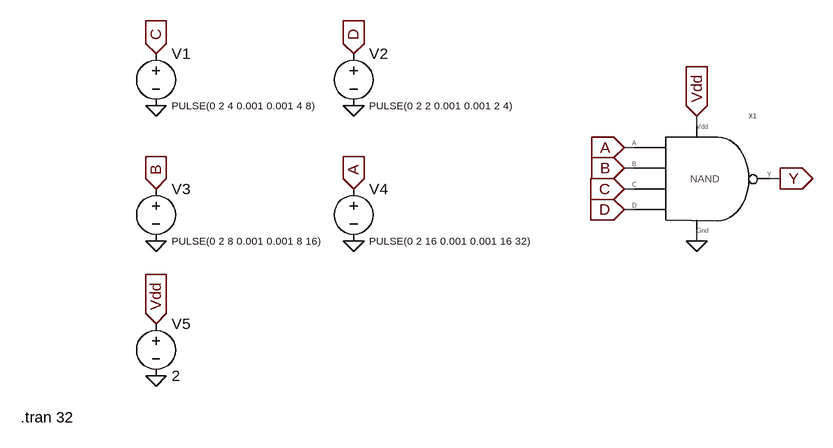
[diagram p0: schematic 4nand symbol.asc]
4nand symbol.asc, the LTspice schematic file:
Version 4
SHEET 1 880 680
WIRE 368 128 368 112
WIRE 272 160 256 160
WIRE 272 192 256 192
WIRE 496 208 480 208
WIRE 272 224 256 224
WIRE 272 256 256 256
WIRE 368 304 368 288
FLAG -464 432 Vdd
IOPIN -464 432 In
FLAG -160 16 D
IOPIN -160 16 In
FLAG -464 16 C
IOPIN -464 16 In
FLAG -464 224 B
IOPIN -464 224 In
FLAG -464 512 0
FLAG -160 304 0
FLAG -464 304 0
FLAG -464 96 0
FLAG -160 96 0
FLAG -160 224 A
IOPIN -160 224 In
FLAG 256 256 D
IOPIN 256 256 In
FLAG 256 224 C
IOPIN 256 224 In
FLAG 256 192 B
IOPIN 256 192 In
FLAG 256 160 A
IOPIN 256 160 In
FLAG 368 112 Vdd
IOPIN 368 112 In
FLAG 368 304 0
FLAG 496 208 Y
IOPIN 496 208 Out
SYMBOL 4nand 352 208 R0
SYMATTR InstName X1
SYMBOL voltage -464 0 R0
WINDOW 3 24 96 Left 1
WINDOW 123 0 0 Left 0
WINDOW 39 0 0 Left 0
SYMATTR Value PULSE(0 2 4 0.001 0.001 4 8)
SYMATTR InstName V1
SYMBOL voltage -160 0 R0
WINDOW 3 24 96 Left 1
WINDOW 123 0 0 Left 0
WINDOW 39 0 0 Left 0
SYMATTR Value PULSE(0 2 2 0.001 0.001 2 4)
SYMATTR InstName V2
SYMBOL voltage -464 208 R0
WINDOW 3 24 96 Left 1
WINDOW 123 0 0 Left 0
WINDOW 39 0 0 Left 0
SYMATTR Value PULSE(0 2 8 0.001 0.001 8 16)
SYMATTR InstName V3
SYMBOL voltage -160 208 R0
WINDOW 3 24 96 Left 1
WINDOW 123 0 0 Left 0
WINDOW 39 0 0 Left 0
SYMATTR Value PULSE(0 2 16 0.001 0.001 16 32)
SYMATTR InstName V4
SYMBOL voltage -464 416 R0
WINDOW 123 0 0 Left 0
WINDOW 39 0 0 Left 0
SYMATTR InstName V5
SYMATTR Value 2
TEXT -672 576 Left 2 !.tran 32

The netlist it stands for:
* 4nand symbol.asc
XX1 Vdd 0 A B C D Y 4nand  ; pins Vdd Gnd A B C D Y
V1 C 0 PULSE(0 2 4 0.001 0.001 4 8)
V2 D 0 PULSE(0 2 2 0.001 0.001 2 4)
V3 B 0 PULSE(0 2 8 0.001 0.001 8 16)
V4 A 0 PULSE(0 2 16 0.001 0.001 16 32)
V5 Vdd 0 2
.tran 32
.backanno
.end

* Results of the author's LTspice run, read from the files saved beside the schematic
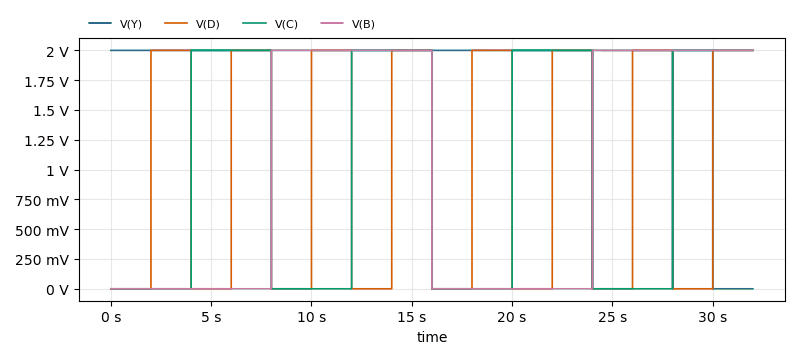
[diagram p1: Transient Analysis of 4nand symbol.asc, plotted from the saved traces]
* Transient Analysis, 1 run:
*   V(Y): min 400.3 nV, max 2 V, average 1.875 V, rms 1.936 V, last 401 nV
*   V(D): min 0 V, max 2 V, average 1 V, rms 1.414 V, last 2 V
*   V(C): min 0 V, max 2 V, average 1 V, rms 1.414 V, last 2 V
*   V(B): min 0 V, max 2 V, average 1 V, rms 1.414 V, last 2 V